# Altium project ratopus.PrjPcb (part 1 of 2)
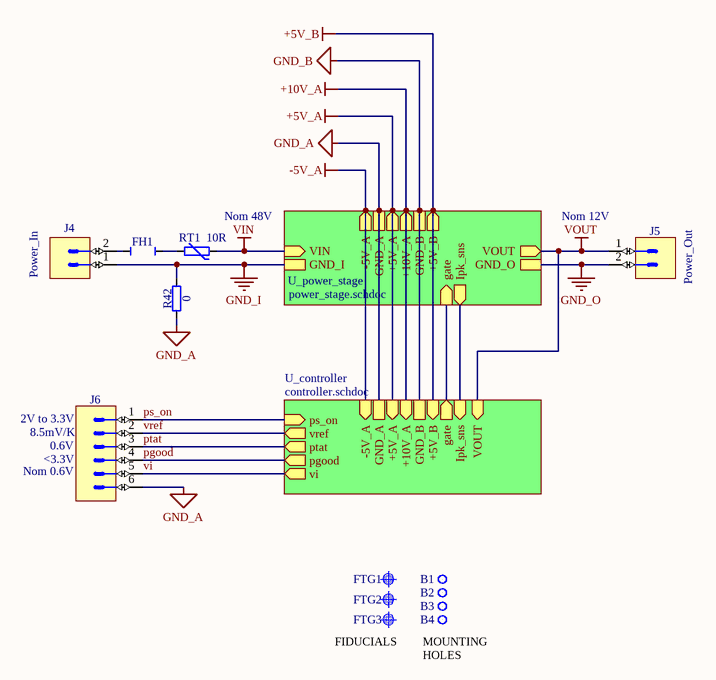
[diagram p0: ratopus.schdoc]
3 sheets, 132 parts. Net scope: hierarchical (ports join the sheet entries above them; power ports are global).
Board file: ratopus.PcbDoc
Sheets:
  ratopus.schdoc
    U_power_stage = power_stage.schdoc
    U_controller = controller.schdoc

## Sheet ratopus.schdoc: RaToPUS DC/DC: Top Level Schematic
size A4; Organization: BE-CO-HT, CERN; Address1: Esplanade des Particules 1; Address2: 1217 Meyrin, Switzerland; Revision: 0.3; SheetNumber: 1; SheetTotal: 3; Author: Lalit Patnaik

### Parts
B1  Non Plated Hole  [MTG270]  (value not drawn)
B2  Non Plated Hole  [MTG270]  (value not drawn)
B3  Non Plated Hole  [MTG270]  (value not drawn)
B4  Non Plated Hole  [MTG270]  (value not drawn)
FH1  Fuse Holder  [FUSH_SCHURTER_0031.7601]  (value not drawn)
FTG1  Use only in PCB  [FIDUCIAL_TOP_C100-200]  (value not drawn)
FTG2  Use only in PCB  [FIDUCIAL_TOP_C100-200]  (value not drawn)
FTG3  Use only in PCB  [FIDUCIAL_TOP_C100-200]  (value not drawn)
J4  (no value)  [PHOENIX_1755736]
J5  (no value)  [PHOENIX_1755736]
J6  Header 6  [JST_B6B-XH-A(LF)(SN)]  (value not drawn)
R42  0  [RESC2012X60N]
RT1  10R  [THERM_TDK_B57236S0]

### Sub-sheets
U_controller = controller.schdoc: VOUT (in), +5V_A (in), +5V_B (in), +10V_A (in), vref (out), ptat (out), pgood (out), vi (out), GND_A, ps_on (in), gate (out), -5V_A (in), Ipk_sns (in), GND_B
U_power_stage = power_stage.schdoc: gate (in), Ipk_sns (out), VIN (in), VOUT (out), +10V_A (out), -5V_A (out), GND_I, GND_O, GND_A, +5V_A (out), +5V_B (out), GND_B

### Nets
+5V_A: sheet U_power_stage/+5V_A, sheet U_controller/+5V_A
+5V_B: sheet U_power_stage/+5V_B, sheet U_controller/+5V_B
+10V_A: sheet U_power_stage/+10V_A, sheet U_controller/+10V_A
-5V_A: sheet U_power_stage/-5V_A, sheet U_controller/-5V_A
GND_A: J6.6 R42.1 ; sheet U_power_stage/GND_A, sheet U_controller/GND_A
GND_B: sheet U_power_stage/GND_B, sheet U_controller/GND_B
GND_I: J4.1 R42.2 ; sheet U_power_stage/GND_I
GND_O: J5.2 ; sheet U_power_stage/GND_O
VIN: RT1.2 ; sheet U_power_stage/VIN
VOUT: J5.1 ; sheet U_power_stage/VOUT, sheet U_controller/VOUT
gate: sheet U_power_stage/gate, sheet U_controller/gate
Ipk_sns: sheet U_power_stage/Ipk_sns, sheet U_controller/Ipk_sns
pgood: J6.4 ; sheet U_controller/pgood
ps_on: J6.1 ; sheet U_controller/ps_on
ptat: J6.3 ; sheet U_controller/ptat
vi: J6.5 ; sheet U_controller/vi
vref: J6.2 ; sheet U_controller/vref
NetFH1_1: FH1.1 J4.2
NetFH1_2: FH1.2 RT1.1

Not connected (* = marked no-connect by the designer): B1 1; B2 1; B3 1; B4 1

### Notes on the sheet
- (near RT1) Nom 48V
- (near J5) Nom 12V
- (near J4) Power_In
- (near J5) Power_Out
- (near J6) 2V to 3.3V
- (near J6) 8.5mV/K
- (near J6) 0.6V
- (near J6) Nom 0.6V
- (near J6) <3.3V
- (near FTG3) FIDUCIALS
- (near B4) MOUNTING HOLES
- Title
- Size:
- Date:
- A4
- Number:
- Time:
- Revision:
- Sheet
- of
- File:

### Library data of the parts
B1-B4 = NON-PLATED_HOLE2.7: Single Terminal Socket; Part Description: Non Plated Through Hole: Hole Dia.=2.7mm; Mounted: No; Part Number: NON-PLATED_HOLE2.7; Component Kind: Standard (No BOM); Component Type: Standard (No BOM); Pin Count: 1; Family: Non Plated Hole; Socket: No; SMD: No; Sense: No; Status: None; ComponentHeight: 0mm; HelpURL: Undefined; Author: CERN DEM BC; CreateDate: 11/11/2015; LatestRevisionDate: 11/11/2015; PackageDescription: Non Plated Through Hole: Hole Dia.=2.7mm
FH1 = FUSH_SCHURTER_0031.7601: Part Description: Vertical Fuse Holder For D8.5 x H8.5mm Subminiature Fuses; PressFit: No; Part Number: FUSH_SCHURTER_0031.7601; Component Kind: Standard; Component Type: Standard; Pin Count: 2; PackageDescription: Vertical Fuse Holder For D8.5x H 8.5mm Subminiature Fuses; Family: Fuse Holder; Mounted: Yes; Socket: No; SMD: No; Sense: No; Manufacturer: SCHURTER; Manufacturer Part Number: 0031.7601; ComponentHeight: 4.4mm; HelpURL: \\cern.ch\dfs\Applications\Altium\Datasheets\FUSH_SCHURTER_0031.7601.pdf; Author: CERN DEM JLC; CreateDate: 12/09/2012; LatestRevisionDate: 12/09/2012
FTG1-FTG3 = FIDUCIAL_TARGET_C100-200: Fiducial Target; Part Description: Round Fiducial Target, Top Layer, 1.0mm, Top Solder 2.0mm, Keepout =2.0mm; Mounted: No; Part Number: FIDUCIAL_TARGET_C100-200; Component Kind: Standard (No BOM); Component Type: Standard (No BOM); Pin Count: 1; Family: Fiducial; Socket: No; SMD: Yes; Sense: No; Status: None; ComponentHeight: 0mm; HelpURL: Undefined; Author: CERN DEM JLC; CreateDate: 09/02/2010; LatestRevisionDate: 04/04/2012; PackageDescription: Round Fiducial Target, Top Layer, 1.0mm, Top Solder 2.0mm, Keepout =2.0mm
J4 J5 = PHOENIX_1755736: Connector 2 Male; Part Description: 12A, 250V, Pitch 5.08mm, 2 Positions Header; Manufacturer: PHOENIX CONTACT; Manufacturer Part Number: 1755736 (MSTBVA 2,5/2-G-5,08); PressFit: No; Part Number: PHOENIX_1755736; Component Kind: Standard; Component Type: Standard; Pin Count: 2; Mounted: Yes; Socket: No; SMD: No; Sense: No; Status: None; ComponentHeight: 12mm; HelpURL: \\cern.ch\dfs\Applications\Altium\Datasheets\PHOENIX_1755736.pdf; Author: CERN DEM JLC; CreateDate: 07/12/2010; LatestRevisionDate: 07/12/2010
J6 = JST_B6B-XH-A(LF)(SN): Connector 6 Male; Part Description: 6 Contacts, 2.5mm Pitch, Top Entry Type Shrouded Header; Manufacturer: JST (JAPAN SOLDERLESS TERMINALS); PressFit: No; Part Number: JST_B6B-XH-A(LF)(SN); Component Kind: Standard; Component Type: Standard; Pin Count: 6; Family: Header 6; Mounted: Yes; Socket: No; SMD: No; Sense: No; Status: None; Manufacturer Part Number: B6B-XH-A(LF)(SN); ComponentHeight: 7mm; HelpURL: \\cern.ch\dfs\Applications\Altium\Datasheets\JST_B6B-XH-A(LF)(SN).pdf; Author: CERN DEM JLC; CreateDate: 26/06/2014; LatestRevisionDate: 26/06/2014
R42 = R0805_0R_JUMPER: Resistor; Part Description: 2A (0.05R Max DC Resistance) Zero Ohm Jumper; Manufacturer: GENERIC; Manufacturer1 Part Number: NRC10Z0; PressFit: No; Part Number: R0805_0R_JUMPER; Component Kind: Standard; Component Type: Standard; Pin Count: 2; Value: 0; Status: Preferred; Manufacturer Part Number: R0805_0R_JUMPER; Case: 0805; Mounted: Yes; Sense: No; Socket: No; SMD: Yes; Manufacturer1 Example: NIC COMPONENT; Manufacturer1 ComponentHeight: 0.6mm; HelpURL: \\cern.ch\dfs\Applications\Altium\Datasheets\R0805_NIC_NRC.pdf; Author: CERN DEM JLC; CreateDate: 03/12/2007; LatestRevisionDate: 13/03/2008
RT1 = THERM_NTC_10R_TDK_B57236S0100M000: Thermistor NTC (Negative Temperature Coefficient); Part Description: Radial Leaded NTC Thermistor For Inrush Current Limiting; Manufacturer: TDK; Power: 3.5A; Voltage: 230VAC; Tolerance: ±20%; Part Number: THERM_NTC_10R_TDK_B57236S0100M000; Component Kind: Standard; Component Type: Standard; Pin Count: 2; Value: 10R; Status: None; Manufacturer Part Number: B57236S0100M000; Mounted: Yes; Socket: No; SMD: No; Sense: No; ComponentHeight: 16mm; HelpURL: \\cern.ch\dfs\Applications\Altium\Datasheets\THERM_NTC_TDK_B57236S0100M000.pdf; Author: CERN DEM JLC; CreateDate: 12/09/2018; LatestRevisionDate: 12/09/2018

## Sheet power_stage.schdoc: RaToPUS DC/DC: Power Stage
size A4; Author: Lalit Patnaik; Organization: BE-CO-HT, CERN; Address1: Esplanade des Particules 1; Address2: 1217 Meyrin, Switzerland; Revision: 0.3; SheetNumber: 2; SheetTotal: 3
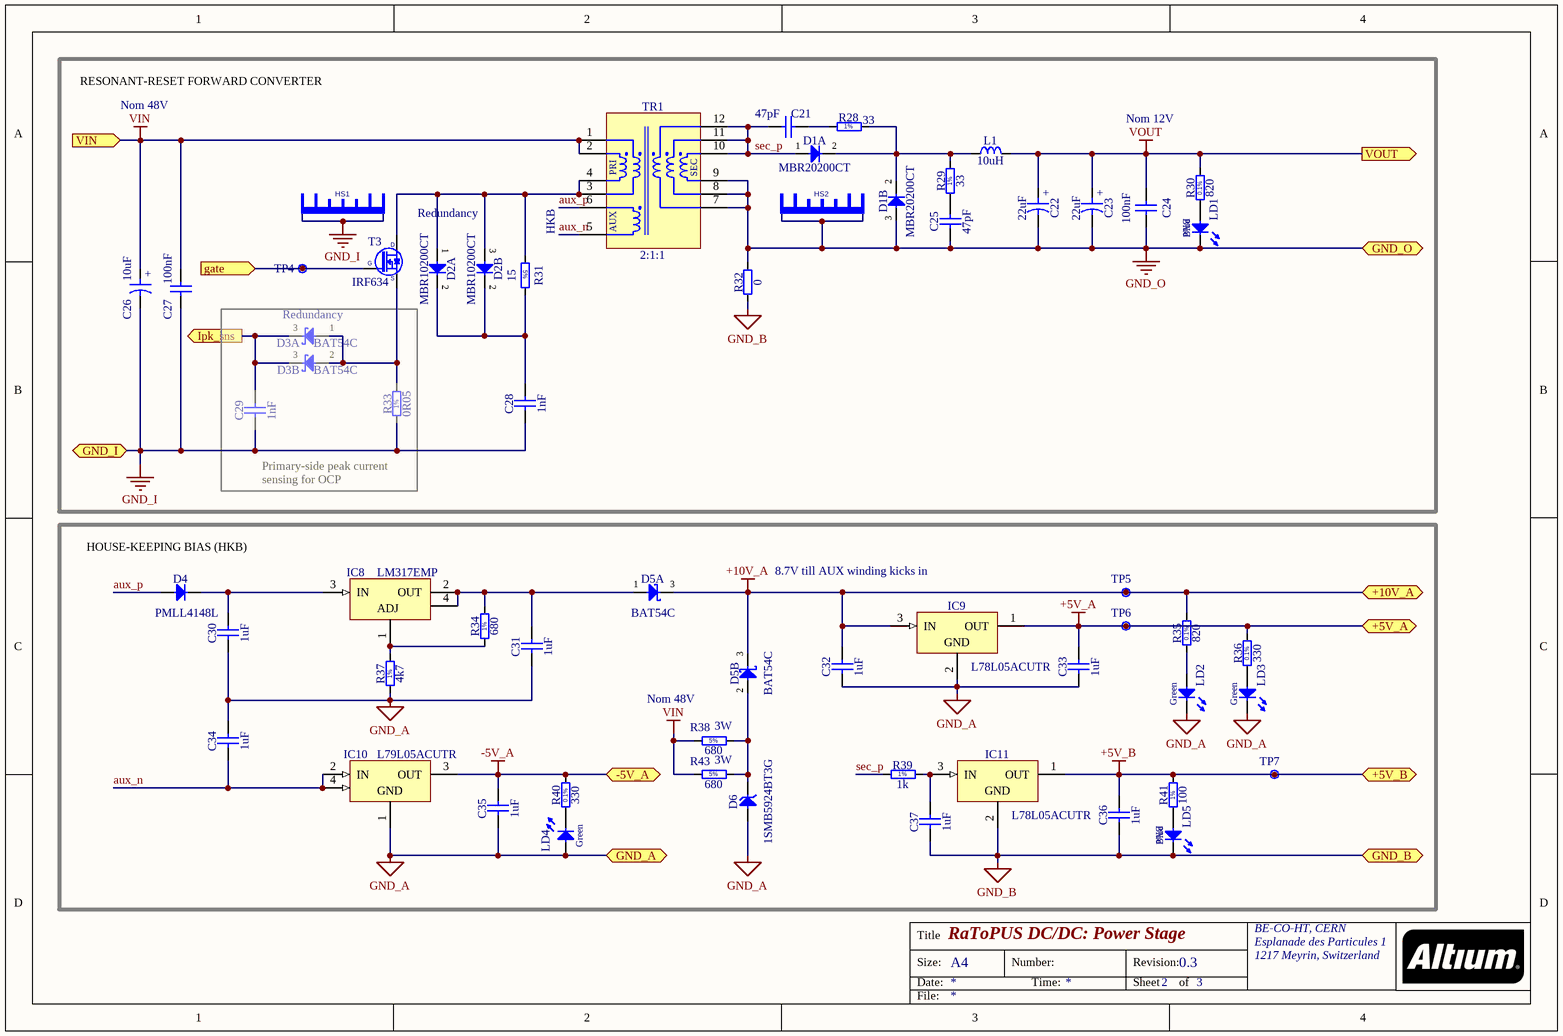
[diagram p1: power_stage.schdoc]

### Parts
C21  47pF  [CAPC2012X88N]
C22  22uF  [CAPPR200-500X700]
C23  22uF  [CAPPR200-500X700]
C24  100nF  [CAPC2012X135N]
C25  47pF  [CAPC2012X88N]
C26  10uF  [CAPPR200-500X1100]
C27  100nF  [CAPC2012X135N]
C28  1nF  [CAPR500-300X720X750]
C29  1nF  [CAPC2013X100N]
C30  1uF  [CAPC3216X140N]
C31  1uF  [CAPC3216X140N]
C32  1uF  [CAPC3216X140N]
C33  1uF  [CAPC3216X140N]
C34  1uF  [CAPC3216X140N]
C35  1uF  [CAPC3216X140N]
C36  1uF  [CAPC3216X140N]
C37  1uF  [CAPC3216X140N]
D1  MBR20200CT  [TO-220-V]  (parts A,B of 2)
D2  MBR10200CT  [TO-220-V]  (parts A,B of 2)
D3  BAT54C  [SOT95P240X130-3N]  (parts A,B of 2)
D4  PMLL4148L  [DIOMELF3515N]
D5  BAT54C  [SOT95P240X130-3N]  (parts A,B of 2)
D6  1SMB5924BT3G  [DIOM5436X244N]
HS1  Heat Sink 2 Pads  [HSINK_AAVID-THERMALLOY_530002B02500G_v]  (value not drawn)
HS2  Heat Sink 2 Pads  [HSINK_AAVID-THERMALLOY_530002B02500G_v]  (value not drawn)
IC8  LM317EMP  [SOT230P700X180-4N]
IC9  L78L05ACUTR  [SOT89]
IC10  L79L05ACUTR  [SOT89]
IC11  L78L05ACUTR  [SOT89]
L1  10uH  [IND_BOURNS_SRP1038A]
LD1  Blue  [LED_KINGBRIGHT_KPH-1608QBC-D]
LD2  Green  [LED_KINGBRIGHT_KPH-1608CGCK]
LD3  Green  [LED_KINGBRIGHT_KPH-1608CGCK]
LD4  Green  [LED_KINGBRIGHT_KPH-1608CGCK]
LD5  Blue  [LED_KINGBRIGHT_KPH-1608QBC-D]
R28  33  [RESC2012X60N]
R29  33  [RESC2012X60N]
R30  820  [RESC2012X60N]
R31  15  [RES1270-650X250]
R32  0  [RESC2012X60N]
R33  0R05  [RESC3216X80N]
R34  680  [RESC2012X60N]
R35  820  [RESC2012X60N]
R36  330  [RESC2012X60N]
R37  4k7  [RESC2012X60N]
R38  680  [RES2286-1670X520]
R39  1k  [RESC2012X60N]
R40  330  [RESC2012X60N]
R41  100  [RESC2012X60N]
R43  680  [RES2286-1670X520]
T3  IRF634  [TO-220-V]
TP4  Test Point  [VERO_20-2136]  (value not drawn)
TP5  Test Point  [VERO_20-2136]  (value not drawn)
TP6  Test Point  [VERO_20-2136]  (value not drawn)
TP7  Test Point  [VERO_20-2136]  (value not drawn)
TR1  2:1:1  [XFMR_COILCRAFT_POE600F]

### Blocks framed on the sheet
Redundancy: C29 D3 R33

### Ports
+5V_A, +5V_B, +10V_A, -5V_A, gate (in), GND_A, GND_B, GND_I, GND_O, Ipk_sns (out), VIN (in), VOUT (out)

### Nets
+5V_A: C33.2 IC9.1(OUT) R36.2 TP6.1 ; port +5V_A
+5V_B: C36.2 IC11.1(OUT) R41.2 TP7.1 ; port +5V_B
+10V_A: C32.2 D5.3(COMC) IC9.3(IN) R35.2 TP5.1 ; port +10V_A
-5V_A: C35.2 IC10.3(OUT) R40.2 ; port -5V_A
GND_A: C30.1 C31.1 C32.1 C33.1 C34.2 C35.1 D6.2(A) IC9.2(GND) IC10.1(GND) LD2.1(C) LD3.1(C) LD4.2(A) R37.1 ; port GND_A
GND_B: C36.1 C37.1 IC11.2(GND) LD5.1(C) R32.1 ; port GND_B
GND_I: C26.2 C27.1 C28.1 C29.1 HS1.1 HS1.2 R33.1 ; port GND_I
GND_O: C22.2 C23.2 C24.1 C25.1 D1.3(A) HS2.1 HS2.2 LD1.1(C) R32.2 TR1.7(SEC) TR1.8(SEC) TR1.9(SEC) ; port GND_O
VIN: C26.1 C27.2 R38.1 R43.1 TR1.1(PRI) TR1.2(PRI) ; port VIN
VOUT: C22.1 C23.1 C24.2 L1.2 R30.2 ; port VOUT
aux_n: C34.1 IC10.2(IN) IC10.4(IN) TR1.5(AUX)
aux_p: D4.2(A) TR1.6(AUX)
gate: T3.1(G) TP4.1 ; port gate
Ipk_sns: C29.2 D3.3(COMC) ; port Ipk_sns
sec_p: C21.1 D1.1(A) R39.1 TR1.10(SEC) TR1.11(SEC) TR1.12(SEC)
NetC21_2: C21.2 R28.1
NetC25_2: C25.2 R29.1
NetC28_2: C28.2 D2.2(COMC) R31.2
NetC30_2: C30.2 D4.1(C) IC8.3(IN)
NetC31_2: C31.2 D5.1(A) IC8.2(OUT) IC8.4(OUT) R34.2
NetC37_2: C37.2 IC11.3(IN) R39.2
NetD1_2: D1.2(COMC) L1.1 R28.2 R29.2
NetD2_1: D2.1(A) D2.3(A) R31.1 T3.2(D) TR1.3(PRI) TR1.4(PRI)
NetD3_1: D3.1(A) D3.2(A) R33.2 T3.3(S)
NetD5_2: D5.2(A) D6.1(C) R38.2 R43.2
NetIC8_1: IC8.1(ADJ) R34.1 R37.2
NetLD1_2: LD1.2(A) R30.1
NetLD2_2: LD2.2(A) R35.1
NetLD3_2: LD3.2(A) R36.1
NetLD4_1: LD4.1(C) R40.1
NetLD5_2: LD5.2(A) R41.1

### Notes on the sheet
- RESONANT-RESET FORWARD CONVERTER
- Nom 48V
- Nom 12V
- Redundancy
- HKB
- Primary-side peak current
  sensing for OCP
- (near D4) HOUSE-KEEPING BIAS (HKB)
- (near IC9) 8.7V till AUX winding kicks in
- (near R38) Nom 48V
- (near R38) 3W
- 3W
- Title
- Size:
- Date:
- A4
- Number:
- Time:
- Revision:
- Sheet
- of
- File:
- (in symbol CAER_10UF_63V_20%_PANASONIC_ECA1JM100) +
- (in symbol CAER_22UF_25V_20%_200-500X700) +
- (in symbol R0805_1K_1%_0.125W_100PPM) 1%
- (in symbol R0805_4K7_1%_0.125W_100PPM) 1%
- (in symbol R0805_33R_1%_0.125W_100PPM) 1%
- (in symbol R0805_100R_1%_0.125W_100PPM) 1%
- (in symbol R0805_330R_0.1%_0.1W_25PPM) 0.1%
- (in symbol R0805_680R_1%_0.125W_100PPM) 1%
- (in symbol R0805_820R_0.1%_0.125W_10PPM) 0.1%
- (in symbol R1206_0R02_1%_1W_150PPM) 1%
- (in symbol RMF_47R_5%_1W_250PPM_1270-650X250) 5%
- (in symbol RMF_680R_5%_3W_250PPM_2286-1670X520) 5%

### Library data of the parts
C21 C25 = CC0805_47PF_50V_5%_C0G_KEMET_C0805C470J5GACAUTO: Non-polarised capacitor; Part Description: SMD Multilayer Chip Ceramic Capacitor (Automotive Grade); Manufacturer: KEMET; Voltage: 50V; TC: CG0/NP0; Tolerance: ±5%; Part Number: CC0805_47PF_50V_5%_C0G_KEMET_C0805C470J5GACAUTO; Component Kind: Standard; Component Type: Standard; Pin Count: 2; Value: 47pF; Status: Not Recommended; Manufacturer Part Number: C0805C470J5GACAUTO; Case: 0805; Mounted: Yes; Socket: No; SMD: Yes; Sense: No; ComponentHeight: 0.88mm; HelpURL: \\cern.ch\dfs\Applications\Altium\Datasheets\CC0805_KEMET_C0805C470J5GACAUTO.pdf; Author: CERN DEM JLC; CreateDate: 23/04/2015; LatestRevisionDate: 23/04/2015
C22 C23 = CAER_22UF_25V_20%_200-500X700: Polarised capacitor; Part Description: Aluminum Electrolytic Capacitor; Manufacturer: GENERIC; Manufacturer1 Part Number: EEAFC1E220; Voltage: 25V; Tolerance: ±20%; Part Number: CAER_22UF_25V_20%_200-500X700; Component Kind: Standard; Component Type: Standard; Pin Count: 2; Value: 22uF; Status: Preferred; Manufacturer Part Number: CAER_22UF_25V_20%_200-500X700; Case: LS2 D5 x H7; Mounted: Yes; Socket: No; SMD: No; Sense: No; ComponentHeight: 7mm; Manufacturer1 Example: PANASONIC; Manufacturer1 ComponentHeight: 7mm; HelpURL: \\cern.ch\dfs\Applications\Altium\Datasheets\CAER_PANASONIC_FC.pdf; Author: CERN DEM JLC; CreateDate: 18/12/2007; LatestRevisionDate: 18/12/2007
C24 C27 = CC0805_100NF_50V_10%_X7R: Non-polarised capacitor; Part Description: SMD Multilayer Chip Ceramic Capacitor; Manufacturer: GENERIC; Manufacturer1 Part Number: C2012X7R1H104K085AA; Voltage: 50V; TC: X7R; Tolerance: ±10%; Part Number: CC0805_100NF_50V_10%_X7R; Component Kind: Standard; Component Type: Standard; Pin Count: 2; Value: 100nF; Status: Preferred; Manufacturer Part Number: CC0805_100NF_50V_10%_X7R; Case: 0805; Mounted: Yes; Socket: No; SMD: Yes; Sense: No; Manufacturer1 Example: TDK; Manufacturer1 ComponentHeight: 1mm; HelpURL: \\cern.ch\dfs\Applications\Altium\Datasheets\CC0805_X7R_TDK_C.pdf; Author: CERN DEM JLC; CreateDate: 03/12/2007; LatestRevisionDate: 22/04/2015
C26 = CAER_10UF_63V_20%_PANASONIC_ECA1JM100: Polarised capacitor; Part Description: Aluminum Electrolytic Capacitor (Series: M Type: A); Voltage: 63V; Tolerance: ±20%; Part Number: CAER_10UF_63V_20%_PANASONIC_ECA1JM100; Component Kind: Standard; Component Type: Standard; Pin Count: 2; Value: 10uF; Status: None; Manufacturer: PANASONIC; Manufacturer Part Number: ECA1JM100; Case: LS2 D5 x H11; Mounted: Yes; Socket: No; SMD: No; Sense: No; ComponentHeight: 11mm; HelpURL: \\cern.ch\dfs\Applications\Altium\Datasheets\CAER_PANASONIC_M.pdf; Author: CERN DEM JLC; CreateDate: 04/03/2009; LatestRevisionDate: 04/03/2009
C28 = CPPR_1NF_400V_10%_WIMA_MKP2: Non-polarised capacitor; Part Description: Metallized Polypropylene Film Capacitor (MKP2); Manufacturer: WIMA; Manufacturer Part Number: MKP2G011001B00KSSD; Voltage: 400VDC; Tolerance: ±10%; Part Number: CPPR_1NF_400V_10%_WIMA_MKP2; Component Kind: Standard; Component Type: Standard; Pin Count: 2; Value: 1nF; Status: None; Case: LS5 W3 x L7.2 x H7.5; Mounted: Yes; Socket: No; SMD: No; Sense: No; ComponentHeight: 7.5mm; HelpURL: \\cern.ch\dfs\Applications\Altium\Datasheets\CPPR_WIMA_MKP2.pdf; Author: CERN DEM MR; CreateDate: 28/08/2018; LatestRevisionDate: 28/08/2018
C29 = CC0805_1NF_25V_1%_C0G: Non-polarised capacitor; Part Description: SMD Multilayer Chip Ceramic Capacitor; Manufacturer: GENERIC; Manufacturer1 Part Number: C0805C102F3GACTU; Voltage: 25V; TC: C0G/NP0; Tolerance: ±1%; Part Number: CC0805_1NF_25V_1%_C0G; Component Kind: Standard; Component Type: Standard; Pin Count: 2; Value: 1nF; Status: None; Manufacturer Part Number: CC0805_1NF_25V_1%_C0G; Case: 0805; Mounted: Yes; Socket: No; SMD: Yes; Sense: No; Manufacturer1 Example: KEMET; Manufacturer1 ComponentHeight: 0.88mm; HelpURL: \\cern.ch\dfs\Applications\Altium\Datasheets\CC0805_C0G_KEMET_(Commercial Grade).pdf; Author: CERN DEM JLC; CreateDate: 11/03/2015; LatestRevisionDate: 11/03/2015
C30-C37 = CC1206_1UF_50V_10%_X7R: Non-polarised capacitor; Part Description: SMD Multilayer Chip Ceramic Capacitor; Manufacturer: GENERIC; Manufacturer1 Part Number: C1206F105K5RACTU; Voltage: 50V; TC: X7R; Tolerance: ±10%; Part Number: CC1206_1UF_50V_10%_X7R; Component Kind: Standard; Component Type: Standard; Pin Count: 2; Value: 1uF; Status: Preferred; Manufacturer Part Number: CC1206_1UF_50V_10%_X7R; Case: 1206; Mounted: Yes; Socket: No; SMD: Yes; Sense: No; Manufacturer1 Example: KEMET; Manufacturer1 ComponentHeight: 1.8mm; HelpURL: \\cern.ch\dfs\Applications\Altium\Datasheets\CC1206_X7R_KEMET_OPENMODE.pdf; Author: CERN DEM JLC; CreateDate: 07/11/2012; LatestRevisionDate: 07/11/2012
D1 = MBR20200CT_v: Dual Common Cathode Diodes; Part Description: Switch‐mode Power Rectifier (Common Cathode); Manufacturer: ON SEMICONDUCTOR; Voltage: 200V; Power: 20A; PressFit: No; Bonding: No; Part Number: MBR20200CT_v; Component Kind: Standard; Component Type: Standard; Device: MBR20200CT; PackageDescription: TO-220 3-Terminal - Vertical; Manufacturer Part Number: MBR20200CT; Pin Count: 3; Case: TO-220-V; Mounted: Yes; Socket: No; SMD: No; Sense: No; ComponentHeight: 19.85mm; HelpURL: \\cern.ch\dfs\Applications\Altium\Datasheets\MBR20200CT.pdf; Author: CERN DEM JLC; CreateDate: 09/06/2015; LatestRevisionDate: 09/06/2015
D2 = MBR20200CT_v: Dual Common Cathode Diodes; Part Number: MBR10200CT_v; Part Description: Switch‐mode Power Rectifier (Common Cathode); Manufacturer: ON SEMICONDUCTOR; Voltage: 200V; Power: 20A; PressFit: No; Bonding: No; Component Kind: Standard; Component Type: Standard; Device: MBR10200CT; PackageDescription: TO-220 3-Terminal - Vertical; Manufacturer Part Number: MBR10200CT; Pin Count: 3; Case: TO-220-V; Mounted: Yes; Socket: No; SMD: No; Sense: No; ComponentHeight: 19.85mm; HelpURL: \\cern.ch\dfs\Applications\Altium\Datasheets\MBR20200CT.pdf; Author: CERN DEM JLC; CreateDate: 09/06/2015; LatestRevisionDate: 09/06/2015
D3 D5 = BAT54C: Dual Common Cathode Schottky Diodes; Part Description: Dual Common Cathode Small Signal Schottky Diode; Manufacturer: FAIRCHILD SEMICONDUCTOR; Voltage: 30V; Power: 200mA; PressFit: No; Bonding: No; Part Number: BAT54C; Component Kind: Standard; Component Type: Standard; Device: BAT54C; PackageDescription: SOT23 3-Leads, Pitch 0.95mm - Body 1.3x2.9mm, IPC Medium Density; Manufacturer Part Number: BAT54C; Pin Count: 3; Case: SOT23-3; Mounted: Yes; Socket: No; SMD: Yes; Sense: No; ComponentHeight: 1.30mm; HelpURL: \\cern.ch\dfs\Applications\Altium\Datasheets\BAT54C.pdf; Author: CERN DEM JLC; CreateDate: 17/09/2009; LatestRevisionDate: 27/05/2010
D4 = PMLL4148L: Diode; Part Description: High-speed switching diodes; Manufacturer: NXP SEMICONDUCTORS; Voltage: 75V; Power: 200mA; PressFit: No; Bonding: No; Part Number: PMLL4148L; Component Kind: Standard; Component Type: Standard; Device: PMLL4148L; PackageDescription: SOD80C, MELF Diode, 2-Leads, Body 3.5x1.5mm, IPC Medium Density; Manufacturer Part Number: PMLL4148L; Pin Count: 2; Case: SOD-80C; Mounted: Yes; Socket: No; SMD: Yes; Sense: No; ComponentHeight: 1.6mm; HelpURL: \\cern.ch\dfs\Applications\Altium\Datasheets\PMLL4148L.pdf; Author: CERN DEM JLC; CreateDate: 30/03/2009; LatestRevisionDate: 09/12/2009
D6 = 1SMB5925BT3G: Zener Diode; Part Description: Plastic Surface Mount Zener Voltage Regulator Diode; Manufacturer: ON SEMICONDUCTOR; Voltage: 9.1V; Power: 3W; PressFit: No; Bonding: No; Part Number: 1SMB5924BT3G; Component Kind: Standard; Component Type: Standard; Device: 1SMB5924BT3G; PackageDescription: DO-214-AA/SMB Diode, Molded Body; 5.40mm L X 3.62mm W X 2.44mm H, IPC Medium Density; Manufacturer Part Number: 1SMB5924BT3G; Pin Count: 2; Case: SMB; Mounted: Yes; Socket: No; SMD: Yes; Sense: No; ComponentHeight: 2.44mm; HelpURL: \\cern.ch\dfs\Applications\Altium\Datasheets\1SMB5925BT3G.pdf; Author: CERN DEM BC; CreateDate: 24/09/2018; LatestRevisionDate: 24/09/2018
HS1 HS2 = HSINK_AAVID-THERMALLOY_530002B02500G_v: Heat Sink With 2 pads; Part Description: TO-220 Extruded Heat Sink Rth: 2.6°C/W  - Height 63.5mm; Manufacturer: AAVID THERMALLOY; PressFit: No; Part Number: HSINK_AAVID-THERMALLOY_530002B02500G_v; Component Kind: Standard; Component Type: Standard; Pin Count: 2; PackageDescription: TO-220 Extruded Heat Sink, Rth: 2.6°C/W  - Vertical Mount - Height 63.5mm; Mounted: Yes; Socket: No; SMD: No; Sense: No; Status: None; Manufacturer Part Number: 530002B02500G; ComponentHeight: 63.5mm; HelpURL: \\cern.ch\dfs\Applications\Altium\Datasheets\HSINK_AAVID-THERMALLOY_530002B02500G.pdf; Author: CERN DEM JLC; CreateDate: 04/06/2015; LatestRevisionDate: 04/06/2015
IC8 = LM317EMP: 3-Terminal Regulator 1=Adj 2=OUT 3=IN 4=OUT; Part Description: 3-Terminal 1.2V To 37V 1A Positive Adjustable Regulator; Manufacturer: TEXAS INSTRUMENTS; PressFit: No; Bonding: No; Part Number: LM317EMP; Component Kind: Standard; Component Type: Standard; Device: LM317EMP; PackageDescription: SOT223, 2.30mm pitch; 3 pin, 3.70mm W X 6.70mm L, IPC Medium Density; Status: Not Recommended; Manufacturer Part Number: LM317EMP; Pin Count: 4; Case: SOT-223; Mounted: Yes; Socket: No; SMD: Yes; Sense: No; ComponentHeight: 1.8mm; HelpURL: \\cern.ch\dfs\Applications\Altium\Datasheets\LM317EMP.pdf; Author: CERN DEM JLC; CreateDate: 02/12/2008; LatestRevisionDate: 16/09/2014
IC9 IC11 = L78L05ACUTR: 3-Terminal Regulator 1=OUT 2=GND 3=IN; Part Description: 5V 100mA Positive Voltage Regulator; Manufacturer: ST MICROELECTRONICS; PressFit: No; Bonding: No; Part Number: L78L05ACUTR; Component Kind: Standard; Component Type: Standard; Device: L78L05ACUTR; PackageDescription: SOT89-3, 3-Leads, Body 2.44x4.5mm; Manufacturer Part Number: L78L05ACUTR; Pin Count: 4; Case: SOT89; Mounted: Yes; Socket: No; SMD: Yes; Sense: No; ComponentHeight: 1.6mm; HelpURL: \\cern.ch\dfs\Applications\Altium\Datasheets\L78L05ACUTR.pdf; Author: CERN DEM JLC; CreateDate: 10/10/2011; LatestRevisionDate: 06/12/2011
IC10 = L79L05ACUTR: 3-Terminal Regulator 1=GND 2=IN 3=OUT 4=IN; Part Description: 5V 100mA Negative Voltage Regulator; Manufacturer: ST MICROELECTRONICS; PressFit: No; Bonding: No; Part Number: L79L05ACUTR; Component Kind: Standard; Component Type: Standard; Device: L79L05ACUTR; PackageDescription: SOT89-3, 3-Leads, Body 2.44x4.5mm; Manufacturer Part Number: L79L05ACUTR; Pin Count: 4; Case: SOT89; Mounted: Yes; Socket: No; SMD: Yes; Sense: No; ComponentHeight: 1.6mm; HelpURL: \\cern.ch\dfs\Applications\Altium\Datasheets\L79L05ACUTR.pdf; Author: CERN DEM JLC; CreateDate: 29/03/2012; LatestRevisionDate: 29/03/2012
L1 = IND_10UH_20%_BOURNS_SRP1038A: Inductor; Part Description: Shielded SMD Power Inductor; Manufacturer: BOURNS; Manufacturer Part Number: SRP1038A-100M; Power: 7.5A; Resistance: 0.027R; Tolerance: ±20%; Part Number: IND_10UH_20%_BOURNS_SRP1038A; Component Kind: Standard; Component Type: Standard; Pin Count: 2; Value: 10uH; Status: None; Mounted: Yes; Socket: No; SMD: Yes; Sense: No; ComponentHeight: 4mm; HelpURL: \\cern.ch\dfs\Applications\Altium\Datasheets\IND_BOURNS_SRP1038A.pdf; Author: CERN DEM MR; CreateDate: 21/09/2018; LatestRevisionDate: 21/09/2018
LD1 LD5 = LED_KINGBRIGHT_KPH-1608QBC-D: LED Blue 1C 2A; Part Description: SMD Blue LED, Case 1.6mmX0.8mm(0603), 0.65mm Thickness; PressFit: No; Bonding: No; Part Number: LED_KINGBRIGHT_KPH-1608QBC-D; Component Kind: Standard; Component Type: Standard; Color: Blue; PackageDescription: SMT Blue LED, Case 0603, Body L 1.6 x W 0.8mm H 0.65mm; Manufacturer: KINGBRIGHT; Manufacturer Part Number: KPH-1608QBC-D; Pin Count: 2; Mounted: Yes; Socket: No; SMD: Yes; Sense: No; ComponentHeight: 0.65mm; HelpURL: \\cern.ch\dfs\Applications\Altium\Datasheets\LED_KINGBRIGHT_KPH-1608QBC-D.pdf; Author: CERN DEM JLC; CreateDate: 03/07/2017; LatestRevisionDate: 03/07/2017
LD2-LD4 = LED_KINGBRIGHT_KPH-1608CGCK: LED Green 1C 2A; Part Description: SMD Green LED, Case 1.6mmX0.8mm(0603), 0.65mm Thickness; PressFit: No; Bonding: No; Part Number: LED_KINGBRIGHT_KPH-1608CGCK; Component Kind: Standard; Component Type: Standard; Color: Green; PackageDescription: SMT Green LED, Case 0603, Body L 1.6 x W 0.8mm H 0.65mm; Manufacturer: KINGBRIGHT; Manufacturer Part Number: KPH-1608CGCK; Pin Count: 2; Mounted: Yes; Socket: No; SMD: Yes; Sense: No; ComponentHeight: 0.65mm; HelpURL: \\cern.ch\dfs\Applications\Altium\Datasheets\LED_KINGBRIGHT_KPH-1608CGCK.pdf; Author: CERN DEM JLC; CreateDate: 03/07/2017; LatestRevisionDate: 03/07/2017
R28 R29 = R0805_33R_1%_0.125W_100PPM: Resistor - 1%; Part Description: General Purpose Thick Film Chip Resistor; Manufacturer: GENERIC; Manufacturer1 Part Number: NRC10F33R0TRF; Power: 0.125W; TC: ±100ppm/°C; PressFit: No; Part Number: R0805_33R_1%_0.125W_100PPM; Component Kind: Standard; Component Type: Standard; Pin Count: 2; Value: 33; Status: Preferred; Tolerance: ±1%; Manufacturer Part Number: R0805_33R_1%_0.125W_100PPM; Case: 0805; Mounted: Yes; Sense: No; Socket: No; SMD: Yes; Manufacturer1 Example: NIC COMPONENT; Manufacturer1 ComponentHeight: 0.6mm; HelpURL: \\cern.ch\dfs\Applications\Altium\Datasheets\R0805_NIC_NRC.pdf; Author: CERN DEM JLC; CreateDate: 03/12/2007; LatestRevisionDate: 13/03/2008
R30 R35 = R0805_820R_0.1%_0.125W_10PPM: Resistor - 0.1%; Part Description: Thin Film Chip Resistor; Manufacturer: GENERIC; Manufacturer1 Part Number: ERA6ARB821P; Power: 0.125W; TC: ±10ppm; PressFit: No; Part Number: R0805_820R_0.1%_0.125W_10PPM; Component Kind: Standard; Component Type: Standard; Pin Count: 2; Value: 820; Status: Not Recommended; Tolerance: ±0.1%; Manufacturer Part Number: R0805_820R_0.1%_0.125W_10PPM; Case: 0805; Mounted: Yes; Sense: No; Socket: No; SMD: Yes; Manufacturer1 Example: PANASONIC; Manufacturer1 ComponentHeight: 0.6mm; HelpURL: \\cern.ch\dfs\Applications\Altium\Datasheets\R0805_PANASONIC_ERA.pdf; Author: CERN DEM JLC; CreateDate: 08/03/2010; LatestRevisionDate: 08/03/2010
R31 = RMF_47R_5%_1W_250PPM_1270-650X250: Resistor - 5%; Part Number: RMF_15R_5%_1W_250PPM_1270-650X250; Part Description: Leaded Power Metal Film Resistor; Manufacturer: GENERIC; Manufacturer1 Part Number: PR01000104709JA100; Power: 1W; TC: ±250ppm/°C; PressFit: No; Component Kind: Standard; Component Type: Standard; Pin Count: 2; Value: 15; Status: Preferred; Tolerance: ±5%; Manufacturer Part Number: RMF_47R_5%_1W_250PPM_1270-650X250; Case: LS12.7 L6.5 x D2.5; Mounted: Yes; Sense: No; Socket: No; SMD: No; ComponentHeight: 2.5mm; Manufacturer1 Example: VISHAY BCCOMPONENT; Manufacturer1 ComponentHeight: 2.5mm; HelpURL: \\cern.ch\dfs\Applications\Altium\Datasheets\RMF_VISHAY_PR01.pdf; Author: CERN DEM JLC; CreateDate: 09/06/2009; LatestRevisionDate: 01/10/2012
R32 = R0805_0R_JUMPER: as R42 on sheet ratopus; Part Number: R0805_0R_JUMPER; Component Kind: Standard; Component Type: Standard; Pin Count: 2; Value: 0; Status: Preferred; Manufacturer Part Number: R0805_0R_JUMPER; Case: 0805; Mounted: Yes; Sense: No; Socket: No; SMD: Yes; Manufacturer1 Example: NIC COMPONENT; Manufacturer1 ComponentHeight: 0.6mm; HelpURL: \\cern.ch\dfs\Applications\Altium\Datasheets\R0805_NIC_NRC.pdf; Author: CERN DEM JLC; CreateDate: 03/12/2007; LatestRevisionDate: 13/03/2008
R33 = R1206_0R02_1%_1W_150PPM: Resistor - 1%; Part Number: R1206_0R05_1%_1W_150PPM; Part Description: Low Value Thick Film Chip Resistor; Manufacturer: PANASONIC; Manufacturer Part Number: ERJ8CWFR050V; Power: 1W; TC: ±150ppm/°C; PressFit: No; Component Kind: Standard; Component Type: Standard; Pin Count: 2; Value: 0R05; Status: Not Recommended; Tolerance: ±1%; Case: 1206; Mounted: Yes; Sense: No; Socket: No; SMD: Yes; ComponentHeight: 0.8mm; HelpURL: \\cern.ch\dfs\Applications\Altium\Datasheets\R1206_PANASONIC_ERJ8BW.pdf; Author: CERN DEM JLC; CreateDate: 03/09/2012; LatestRevisionDate: 03/09/2012
R34 = R0805_680R_1%_0.125W_100PPM: Resistor - 1%; Part Description: General Purpose Thick Film Chip Resistor; Manufacturer: GENERIC; Manufacturer1 Part Number: NRC10F6800TRF; Power: 0.125W; TC: ±100ppm/°C; PressFit: No; Part Number: R0805_680R_1%_0.125W_100PPM; Component Kind: Standard; Component Type: Standard; Pin Count: 2; Value: 680; Status: Preferred; Tolerance: ±1%; Manufacturer Part Number: R0805_680R_1%_0.125W_100PPM; Case: 0805; Mounted: Yes; Sense: No; Socket: No; SMD: Yes; Manufacturer1 Example: NIC COMPONENT; Manufacturer1 ComponentHeight: 0.6mm; HelpURL: \\cern.ch\dfs\Applications\Altium\Datasheets\R0805_NIC_NRC.pdf; Author: CERN DEM JLC; CreateDate: 03/12/2007; LatestRevisionDate: 13/03/2008
R36 R40 = R0805_330R_0.1%_0.1W_25PPM: Resistor - 0.1%; Part Description: Precision Surface Mount Resistor; Manufacturer: GENERIC; Manufacturer1 Part Number: PCF0805PR-330RBT1; Power: 0.1W; TC: ±25ppm/°C; PressFit: No; Part Number: R0805_330R_0.1%_0.1W_25PPM; Component Kind: Standard; Component Type: Standard; Pin Count: 2; Value: 330; Status: Not Recommended; Tolerance: ±0.1%; Manufacturer Part Number: R0805_330R_0.1%_0.1W_25PPM; Case: 0805; Mounted: Yes; Sense: No; Socket: No; SMD: Yes; Manufacturer1 Example: TT ELECTRONICS; Manufacturer1 ComponentHeight: 0.5mm; HelpURL: \\cern.ch\dfs\Applications\Altium\Datasheets\R0805_TT ELECTRONICS_PCF.pdf; Author: CERN DEM JLC; CreateDate: 05/10/2010; LatestRevisionDate: 25/10/2018
R37 = R0805_4K7_1%_0.125W_100PPM: Resistor - 1%; Part Description: General Purpose Thick Film Chip Resistor; Manufacturer: GENERIC; Manufacturer1 Part Number: NRC10F4701TRF; Power: 0.125W; TC: ±100ppm/°C; PressFit: No; Part Number: R0805_4K7_1%_0.125W_100PPM; Component Kind: Standard; Component Type: Standard; Pin Count: 2; Value: 4k7; Status: Preferred; Tolerance: ±1%; Manufacturer Part Number: R0805_4K7_1%_0.125W_100PPM; Case: 0805; Mounted: Yes; Sense: No; Socket: No; SMD: Yes; Manufacturer1 Example: NIC COMPONENT; Manufacturer1 ComponentHeight: 0.6mm; HelpURL: \\cern.ch\dfs\Applications\Altium\Datasheets\R0805_NIC_NRC.pdf; Author: CERN DEM JLC; CreateDate: 03/12/2007; LatestRevisionDate: 13/03/2008
R38 R43 = RMF_680R_5%_3W_250PPM_2286-1670X520: Resistor - 5%; Part Description: Leaded Power Metal Film Resistor; Manufacturer: GENERIC; Manufacturer1 Part Number: PR03000206800JAC00; Power: 3W; TC: ±250ppm/°C; PressFit: No; Part Number: RMF_680R_5%_3W_250PPM_2286-1670X520; Component Kind: Standard; Component Type: Standard; Pin Count: 2; Value: 680; Status: Preferred; Tolerance: ±5%; Manufacturer Part Number: RMF_680R_5%_3W_250PPM_2286-1670X520; Case: LS22.86 L16.7 x D5.2; Mounted: Yes; Sense: No; Socket: No; SMD: No; ComponentHeight: 5.2mm; Manufacturer1 Example: VISHAY BCCOMPONENT; Manufacturer1 ComponentHeight: 5.2mm; HelpURL: \\cern.ch\dfs\Applications\Altium\Datasheets\RMF_VISHAY_PR03.pdf; Author: CERN DEM JLC; CreateDate: 19/06/2008; LatestRevisionDate: 01/10/2012
R39 = R0805_1K_1%_0.125W_100PPM: Resistor - 1%; Part Description: General Purpose Thick Film Chip Resistor; Manufacturer: GENERIC; Manufacturer1 Part Number: NRC10F1001TRF; Power: 0.125W; TC: ±100ppm/°C; PressFit: No; Part Number: R0805_1K_1%_0.125W_100PPM; Component Kind: Standard; Component Type: Standard; Pin Count: 2; Value: 1k; Status: Preferred; Tolerance: ±1%; Manufacturer Part Number: R0805_1K_1%_0.125W_100PPM; Case: 0805; Mounted: Yes; Sense: No; Socket: No; SMD: Yes; Manufacturer1 Example: NIC COMPONENT; Manufacturer1 ComponentHeight: 0.6mm; HelpURL: \\cern.ch\dfs\Applications\Altium\Datasheets\R0805_NIC_NRC.pdf; Author: CERN DEM JLC; CreateDate: 03/12/2007; LatestRevisionDate: 13/03/2008
R41 = R0805_100R_1%_0.125W_100PPM: Resistor - 1%; Part Description: General Purpose Thick Film Chip Resistor; Manufacturer: GENERIC; Manufacturer1 Part Number: NRC10F4700TRF; Power: 0.125W; TC: ±100ppm/°C; PressFit: No; Part Number: R0805_100R_1%_0.125W_100PPM; Component Kind: Standard; Component Type: Standard; Pin Count: 2; Value: 100; Status: Preferred; Tolerance: ±1%; Manufacturer Part Number: R0805_100R_1%_0.125W_100PPM; Case: 0805; Mounted: Yes; Sense: No; Socket: No; SMD: Yes; Manufacturer1 Example: NIC COMPONENT; Manufacturer1 ComponentHeight: 0.6mm; HelpURL: \\cern.ch\dfs\Applications\Altium\Datasheets\R0805_NIC_NRC.pdf; Author: CERN DEM JLC; CreateDate: 03/12/2007; LatestRevisionDate: 13/03/2008
T3 = IRF630PBF_v: N-CHANNEL MOSFET WITH DIODE; Part Number: IRF634_v; Part Description: 200V 9A N-Channel Power MOSFET; Manufacturer: VISHAY SILICONIX; PressFit: No; Bonding: No; Component Kind: Standard; Component Type: Standard; Device: IRF634; PackageDescription: TO-220 3-Terminal - Vertical; Manufacturer Part Number: IRF634; Pin Count: 3; Case: TO-220; Mounted: Yes; Socket: No; SMD: No; Sense: No; ComponentHeight: 19.3mm; HelpURL: \\cern.ch\dfs\Applications\Altium\Datasheets\IRF630PBF.pdf; Author: CERN DEM JLC; CreateDate: 19/06/2017; LatestRevisionDate: 19/06/2017
TP4-TP7 = VERO_20-2136: Part Description: Black Bead PCB Terminal Test Pin for 1.6mm PCB Thickness (1.32mm Hole); Manufacturer: VERO TECHNOLOGIES; PressFit: No; Part Number: VERO_20-2136; Component Kind: Standard; Component Type: Standard; Pin Count: 1; Family: Test Point; Mounted: Yes; Socket: No; SMD: No; Sense: No; Status: None; Manufacturer Part Number: 20-2136; ComponentHeight: 5.3mm; HelpURL: \\cern.ch\dfs\Applications\Altium\Datasheets\VERO_20-2136.pdf; Author: CERN DEM JLC; CreateDate: 21/07/2008; LatestRevisionDate: 15/07/2013
TR1 = XFMR_COILCRAFT_POE600F-12L: 60W PoE Transformer; Part Number: XFMR_COILCRAFT_POE600F-12L; Component Kind: Standard; Component Type: Standard; Pin Count: 12; Value: 2:1:1; Status: None; Part Description: 60W PoE Transformer; Manufacturer: COILCRAFT; Manufacturer Part Number: POE600F-12L; Mounted: Yes; Socket: No; Sense: No; SMD: Yes; ComponentHeight: 11.43mm; HelpURL: \\cern.ch\dfs\Applications\Altium\Datasheets\XFMR_COILCRAFT_POE600F.pdf; Author: CERN DEM JLC; CreateDate: 04/03/2019; LatestRevisionDate: 04/03/2019